# Altium schematic sheet pi_3.3v_5v_switches.SchDoc: Data Logger - RPI 3.3V,5V Switches
size A4; DocumentNumber: DL-MB-9; SheetNumber: 9; SheetTotal: 11
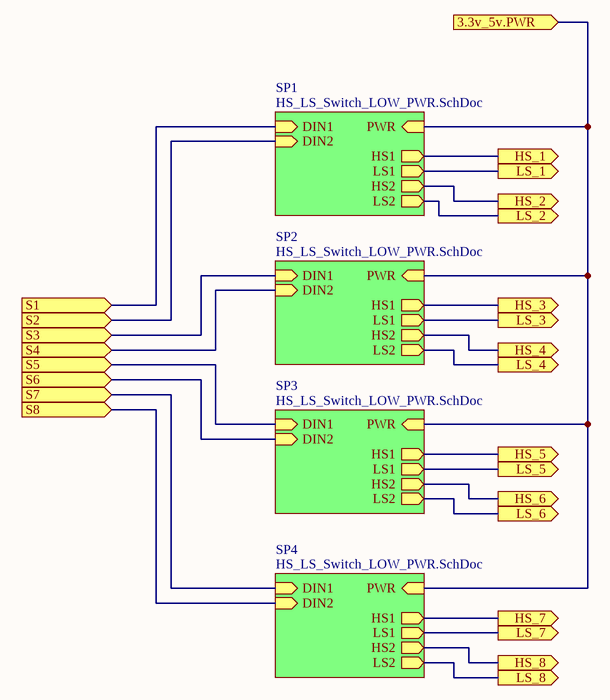
[diagram p0: pi_3.3v_5v_switches.SchDoc]

## Sub-sheets
SP1 = HS_LS_Switch_LOW_PWR.SchDoc: DIN1 (in), DIN2 (in), HS1 (out), LS1 (out), HS2 (out), LS2 (out), PWR (in)
SP2 = HS_LS_Switch_LOW_PWR.SchDoc: DIN1 (in), DIN2 (in), HS1 (out), LS1 (out), HS2 (out), LS2 (out), PWR (in)
SP3 = HS_LS_Switch_LOW_PWR.SchDoc: DIN1 (in), DIN2 (in), HS1 (out), LS1 (out), HS2 (out), LS2 (out), PWR (in)
SP4 = HS_LS_Switch_LOW_PWR.SchDoc: DIN1 (in), DIN2 (in), HS1 (out), LS1 (out), HS2 (out), LS2 (out), PWR (in)

## Ports
3.3v_5v.PWR (in), HS_1 (out), HS_2 (out), HS_3 (out), HS_4 (out), HS_5 (out), HS_6 (out), HS_7 (out), HS_8 (out), LS_1 (out), LS_2 (out), LS_3 (out), LS_4 (out), LS_5 (out), LS_6 (out), LS_7 (out), LS_8 (out), S1 (in), S2 (in), S3 (in), S4 (in), S5 (in), S6 (in), S7 (in), S8 (in)

## Nets
3.3v_5v.PWR: port 3.3v_5v.PWR, sheet SP1/PWR, sheet SP2/PWR, sheet SP3/PWR, sheet SP4/PWR
HS_1: port HS_1, sheet SP1/HS1
HS_2: port HS_2, sheet SP1/HS2
HS_3: port HS_3, sheet SP2/HS1
HS_4: port HS_4, sheet SP2/HS2
HS_5: port HS_5, sheet SP3/HS1
HS_6: port HS_6, sheet SP3/HS2
HS_7: port HS_7, sheet SP4/HS1
HS_8: port HS_8, sheet SP4/HS2
LS_1: port LS_1, sheet SP1/LS1
LS_2: port LS_2, sheet SP1/LS2
LS_3: port LS_3, sheet SP2/LS1
LS_4: port LS_4, sheet SP2/LS2
LS_5: port LS_5, sheet SP3/LS1
LS_6: port LS_6, sheet SP3/LS2
LS_7: port LS_7, sheet SP4/LS1
LS_8: port LS_8, sheet SP4/LS2
S1: port S1, sheet SP1/DIN1
S2: port S2, sheet SP1/DIN2
S3: port S3, sheet SP2/DIN1
S4: port S4, sheet SP2/DIN2
S5: port S5, sheet SP3/DIN1
S6: port S6, sheet SP3/DIN2
S7: port S7, sheet SP4/DIN1
S8: port S8, sheet SP4/DIN2

## Notes on the sheet
- Title
- Size
- Date:
- A4
- Number
- Time:
- Sheet
- of
- Revision
- File:
- Drawn By: